# EAGLE design DC-DC Converter Module V1.1 (EAGLE 9.2.2)
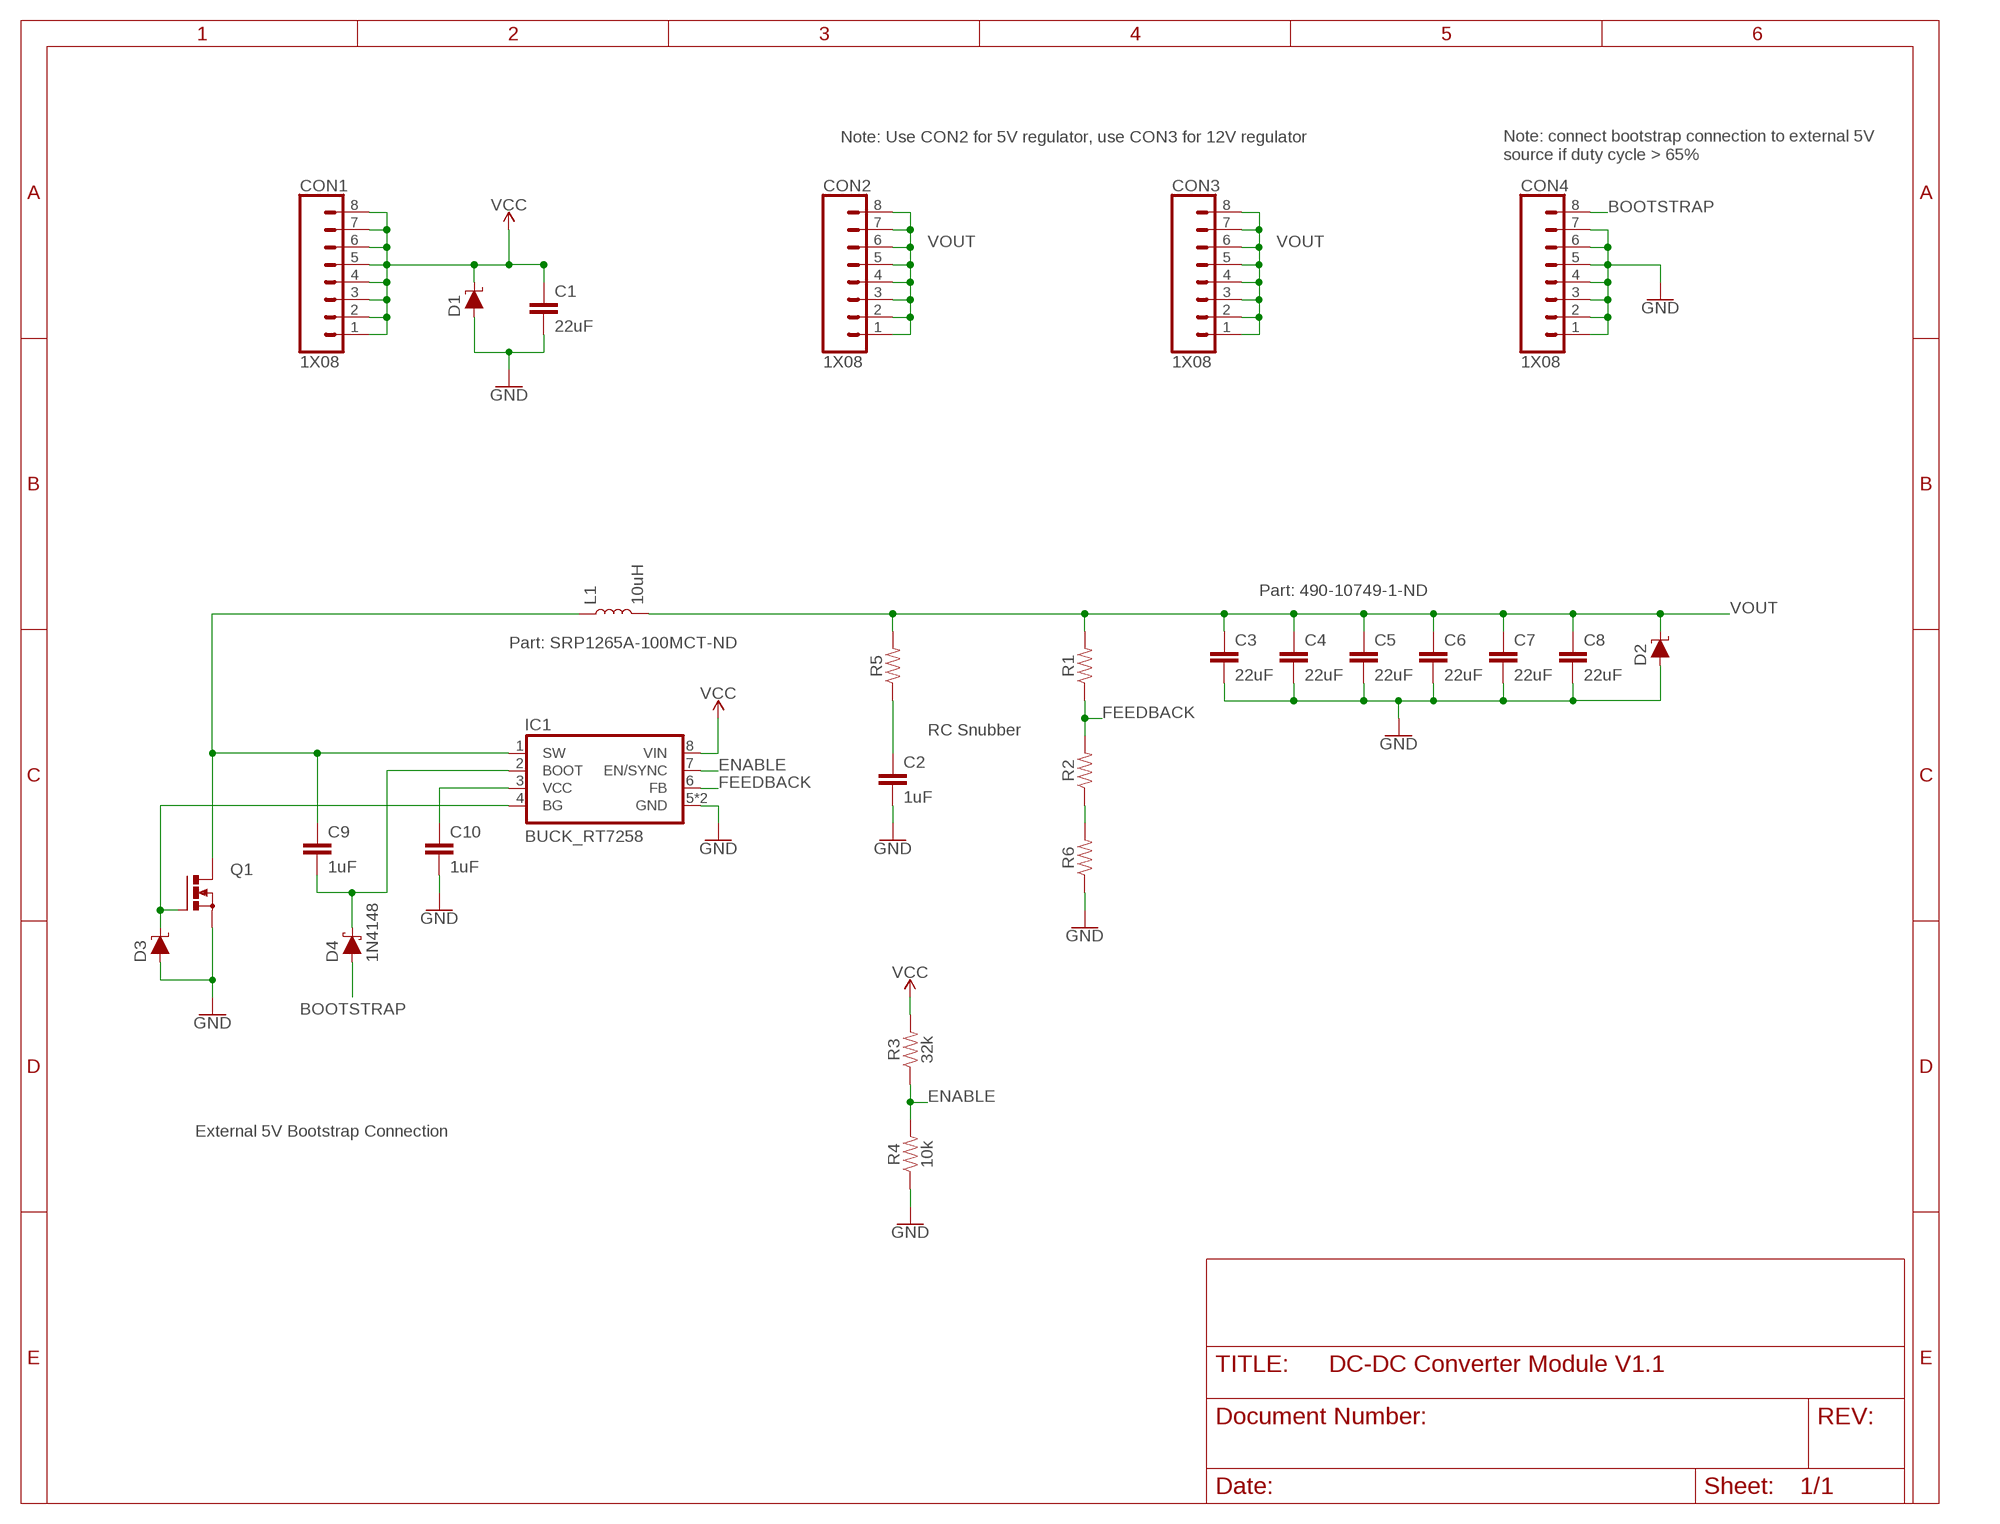
[diagram p0: schematic, sheet 1]

## Parts
C1  22uF  CAPACITOR_1210  [1210]
C2  1uF  CAPACITOR_0805  [0805]
C3  22uF  CAPACITOR_0805  [0805]
C4  22uF  CAPACITOR_0805  [0805]
C5  22uF  CAPACITOR_0805  [0805]
C6  22uF  CAPACITOR_0805  [0805]
C7  22uF  CAPACITOR_0805  [0805]
C8  22uF  CAPACITOR_0805  [0805]
C9  1uF  CAPACITOR_0805  [0805]
C10  1uF  CAPACITOR_0805  [0805]
CON1  1X08  [1X08]
CON2  1X08  [1X08]
CON3  1X08  [1X08]
CON4  1X08  [1X08]
D1  DIODE_TVS_DO-214AA  [DO214AA]
D2  DIODE_TVS_DO-214AA  [DO214AA]
D3  DIODE_TVS_DO-214AA  [DO214AA]
D4  1N4148  DIODE_SCHOTTKY_SOD123F  [SOD123FL]
IC1  BUCK_RT7258  [SOP-8_HEATSINK]
L1  10uH  INDUCTOR_BOURNS_SRP1265A  [INDUCTOR_BOURNS_SRP1265A]
Q1  MOSFET_NMOS_TO-263  [TO-263/D2PAK]
R1  RESISTOR_0805  [0805]
R2  RESISTOR_0805  [0805]
R3  32k  RESISTOR_0805  [0805]
R4  10k  RESISTOR_0805  [0805]
R5  RESISTOR_0805  [0805]
R6  RESISTOR_0805  [0805]

## Nets
BOOTSTRAP: CON4.8 D4.A
ENABLE: IC1.7(EN/SYNC) R3.1 R4.2
FEEDBACK: IC1.6(FB) R1.1 R2.2
GND: C1.2 C2.2 C3.2 C4.2 C5.2 C6.2 C7.2 C8.2 C10.2 CON4.1 CON4.2 CON4.3 CON4.4 CON4.5 CON4.6 CON4.7 D1.A D2.A D3.A IC1.5(GND) IC1.GND Q1.3(S) R4.1 R6.1
N$1: C2.1 R5.1
N$2: C9.1 IC1.1(SW) L1.1 Q1.2(D)
N$3: R2.1 R6.2
N$4: D3.C IC1.4(BG) Q1.1(G)
N$5: C9.2 D4.C IC1.2(BOOT)
N$6: C10.1 IC1.3(VCC)
VCC: C1.1 CON1.1 CON1.2 CON1.3 CON1.4 CON1.5 CON1.6 CON1.7 CON1.8 D1.C IC1.8(VIN) R3.2
VOUT: C3.1 C4.1 C5.1 C6.1 C7.1 C8.1 CON2.1 CON2.2 CON2.3 CON2.4 CON2.5 CON2.6 CON2.7 CON2.8 CON3.1 CON3.2 CON3.3 CON3.4 CON3.5 CON3.6 CON3.7 CON3.8 D2.C L1.2 R1.2 R5.2

## Notes on the sheet
- Note: Use CON2 for 5V regulator, use CON3 for 12V regulator
- Note: connect bootstrap connection to external 5V 
  source if duty cycle > 65%
- Part: 490-10749-1-ND
- Part: SRP1265A-100MCT-ND
- RC Snubber
- External 5V Bootstrap Connection

## Library data of the parts
C1 = EcoCar-Passives:CAPACITOR_1210
C2-C10 = EcoCar-Passives:CAPACITOR_0805
CON1-CON4 = EcoCar-Connectors-2.54mm:1X08: 2.54mm (0.1") Header
D1-D3 = EcoCar-Fuses-Protection:DIODE_TVS_DO-214AA
D4 = EcoCar-Discrete-Semiconductors:DIODE_SCHOTTKY_SOD123F
IC1 = EcoCar-Integrated-Circuits:BUCK_RT7258: Richtek 8A Buck Converter Manufacturer: Richtek Part Number: RT7258GSP Digikey Part Number: 1028-1214-1-ND
L1 = EcoCar-Passives:INDUCTOR_BOURNS_SRP1265A
Q1 = EcoCar-Discrete-Semiconductors:MOSFET_NMOS_TO-263
R1-R6 = EcoCar-Passives:RESISTOR_0805

## Board
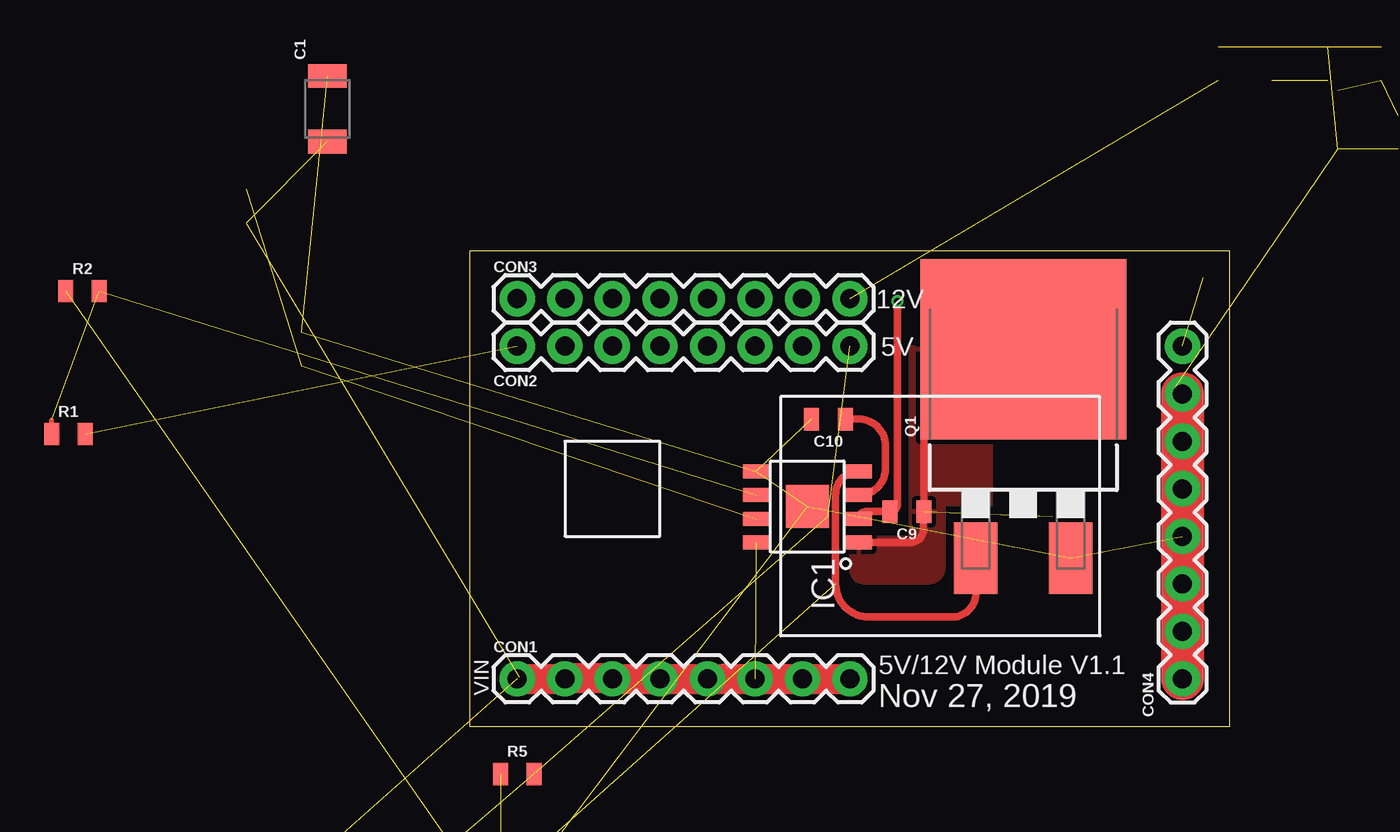
[diagram p1: board, top side]
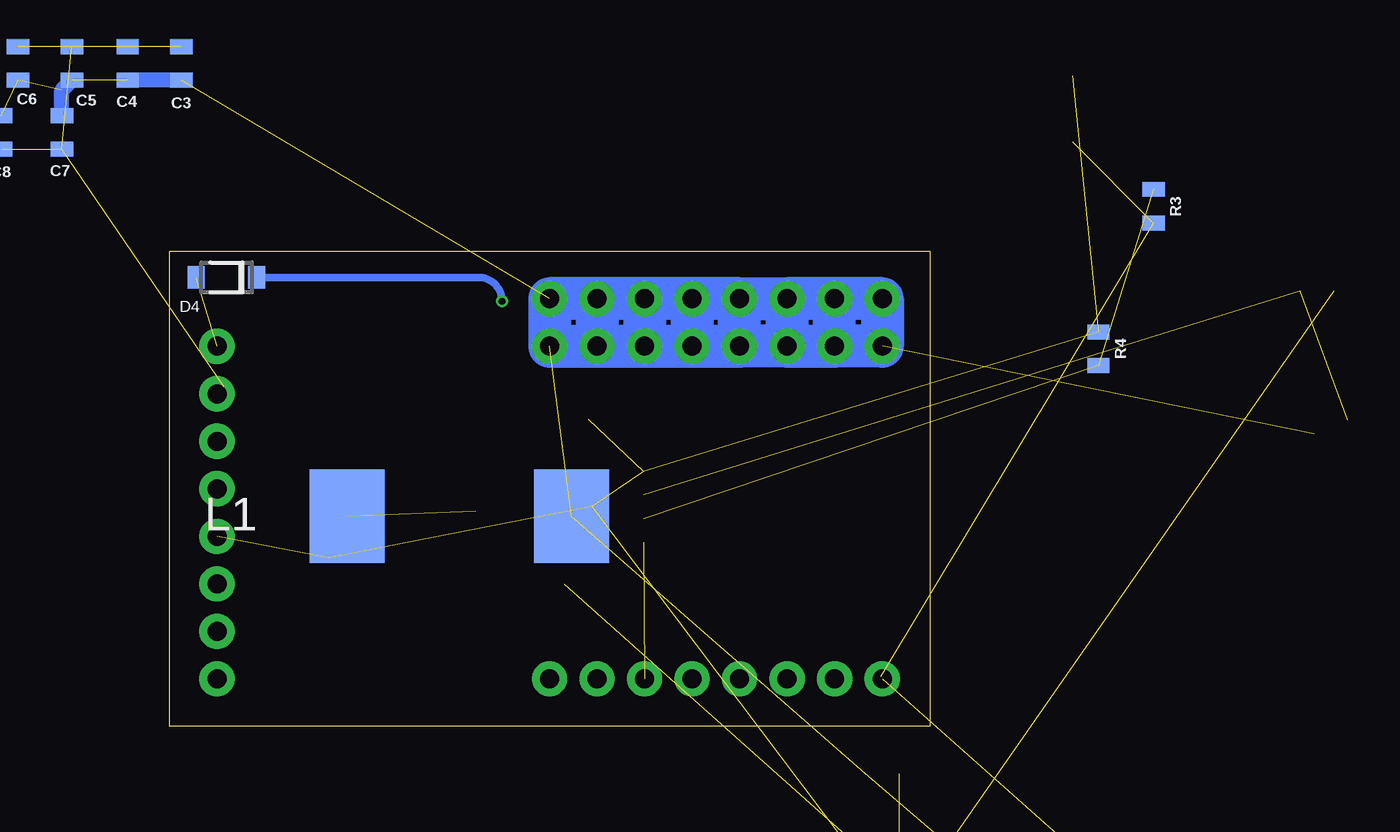
[diagram p2: board, bottom side, seen from below]

Size 40.64 x 25.4 mm. Coordinates in mm from the lower left corner, seen from the top.
Outline: 0,0 40.64,0 40.64,25.4 0,25.4 0,0
Copper layers (1*16): Top 0.035mm / dielectric 1.5mm / Bottom 0.035mm
Design rules "JLCPCB2Layer": minimum track width 6mil, minimum drill 10mil, track to track 6mil, track to pad 6mil, pad to pad 6mil, via to via 6mil, smd to smd 0mil, copper to edge 10mil, drill to drill 10mil, minimum pad ring 6mil, minimum via ring 6mil, stop-mask expansion 2mil, vias tented up to drill 100mil, thermal gap 10mil

### Footprints (pad centres in the part's own frame; a part is rotated, then mirrored left to right if it is on the bottom)
1210 = smd 1.27 x 2.06: 1 -1.755,0; 2 1.755,0
0805 = smd 0.8 x 1.2: 1 -0.9,0; 2 0.9,0
1X08 = drill 1.016 pad 1.88: 1 0,0; 2 2.54,0; 3 5.08,0; 4 7.62,0; 5 10.16,0; 6 12.7,0; 7 15.24,0; 8 17.78,0
DO214AA = smd 1.8 x 2.2: A 2.55,0; C -2.55,0
SOD123FL = smd 0.91 x 1.22: A 1.625,0; C -1.625,0
SOP-8_HEATSINK = smd 0.75 x 1.4: 1 0.528,-0.8; 2 1.798,-0.8; 3 3.068,-0.8; 4 4.338,-0.8; 5 4.338,4.7; 6 3.068,4.7; 7 1.798,4.7; 8 0.528,4.7 | smd 2.3 x 2.3: GND 2.45,1.955
INDUCTOR_BOURNS_SRP1265A = smd 4 x 5: 1 0,0; 2 12,0
TO-263/D2PAK = smd 2.32 x 3.81: 1 -2.54,-7.045; 3 2.54,-7.045 | smd 11 x 9.65: 2 0,4.125

### Placement (x,y rotation side)
C1  -7.62,33.02 90 top  (outside the outline)
C2  2.54,-7.62 0 top  (outside the outline)
C3  40.01,35.44 90 bottom  (outside the outline)
C4  42.87,35.44 90 bottom  (outside the outline)
C5  45.86,35.44 90 bottom  (outside the outline)
C6  48.73,35.44 90 bottom  (outside the outline)
C7  46.39,31.75 270 bottom  (outside the outline)
C8  49.63,31.75 270 bottom  (outside the outline)
C9  23.36,11.48 180 top
C10  19.17,16.43 180 top
CON1  2.54,2.54 0 top
CON2  2.54,20.32 0 top
CON3  2.54,22.86 0 top
CON4  38.1,2.54 90 top
D1  -17.78,-17.78 0 top  (outside the outline)
D2  -17.78,-22.86 0 top  (outside the outline)
D3  -17.78,-27.94 0 top  (outside the outline)
D4  37.59,24 180 bottom
IC1  19.99,9.3 90 top
L1  31.15,11.22 0 bottom
Q1  29.59,16.04 0 top
R1  -21.46,15.63 0 top  (outside the outline)
R2  -20.7,23.27 0 top  (outside the outline)
R3  -11.96,27.81 270 bottom  (outside the outline)
R4  -9.02,20.19 270 bottom  (outside the outline)
R5  2.54,-2.54 0 top
R6  2.54,-12.7 0 top  (outside the outline)

### Tracks (layer width: path | path; a pad name or v marks a point on that pad's centre or on a via)
BOOTSTRAP  (1 unrouted)
ENABLE  (2 unrouted)
FEEDBACK  (2 unrouted)
  Top 0.254: R1.1 -22.36,16.38
GND  (17 unrouted)
  Top 2.3: CON4.7 CON4.6 CON4.5 CON4.4 CON4.3 CON4.2 CON4.1
  Bottom 0.813: 37.73,18.15 CON4.7
N$1  (1 unrouted)
N$2  (1 unrouted)
  Top 0.406: IC1.1 23.54,9.83 arc90 24.26,10.54 C9.1 24.27,20.16 Q1.2
  pour Top: 20.32,10.16 23.5,10.16 23.5,20.32 27.94,20.32 27.94,11.94 27.94,11.81 25.4,11.81 25.4,10.16 25.4,8.51 arc-90 24.51,7.62 21.08,7.62 arc-90 20.32,8.38
N$3  (1 unrouted)
N$4  (1 unrouted)
  Top 0.406: IC1.4 arc90 19.56,12.4 19.56,7.62 arc90 21.34,5.84 25.78,5.84 arc90 27.05,7.11 Q1.1
N$5  (via drill 0.35)
  Top 0.406: IC1.2 arc-90 21.18,11.48 C9.2 arc90 22.86,11.87 v22.86,22.73
  Bottom 0.406: v22.86,22.73 arc-90 24.13,24 D4.C
N$6
  Top 0.406: C10.1 20.78,16.43 arc-90 22.23,14.99 22.23,13.8 arc-90 IC1.3
VCC  (4 unrouted)
  Top 0.254: CON1.1 2.65,2.65
  Top 1: 7.67,2.59 CON1.3
  Top 1.6: CON1.1 CON1.2 5.13,2.59 7.67,2.59 | CON1.3 CON1.4 CON1.5 | CON1.8 CON1.7 CON1.6 CON1.5 | CON1.5 13.59,2.54
  Bottom 0.813: CON1.8 20.54,2.76
VOUT  (8 unrouted)
  Bottom 0.813: C3.1 C4.1 | C7.1 46.39,34.01 C5.1
  Bottom 2.3: CON2.2 CON2.1 CON3.1 CON3.2 | CON2.2 CON3.2 | CON3.2 CON3.3 | CON3.3 CON2.3 | CON2.3 CON2.4 | CON2.4 CON3.4 | CON3.4 CON3.3 | CON3.4 CON3.5 | CON3.5 CON3.6 | CON3.6 CON3.7 | CON3.7 CON3.8 CON2.8 CON2.7 | CON2.7 CON2.6 | CON2.6 CON2.5 | CON2.5 CON2.4 | CON2.3 CON2.2 | CON3.7 CON2.7 | CON3.6 CON2.6 | CON3.5 CON2.5

### Text on the board
tPlace: GND | 12V | 5V | 5V/12V Module V1.1 | VIN | Nov 27, 2019